# Altium schematic sheet [10] - CPU - JTAG, CONTROL.SchDoc
size A2; DocumentNumber: 10; SheetNumber: 10; SheetTotal: 20
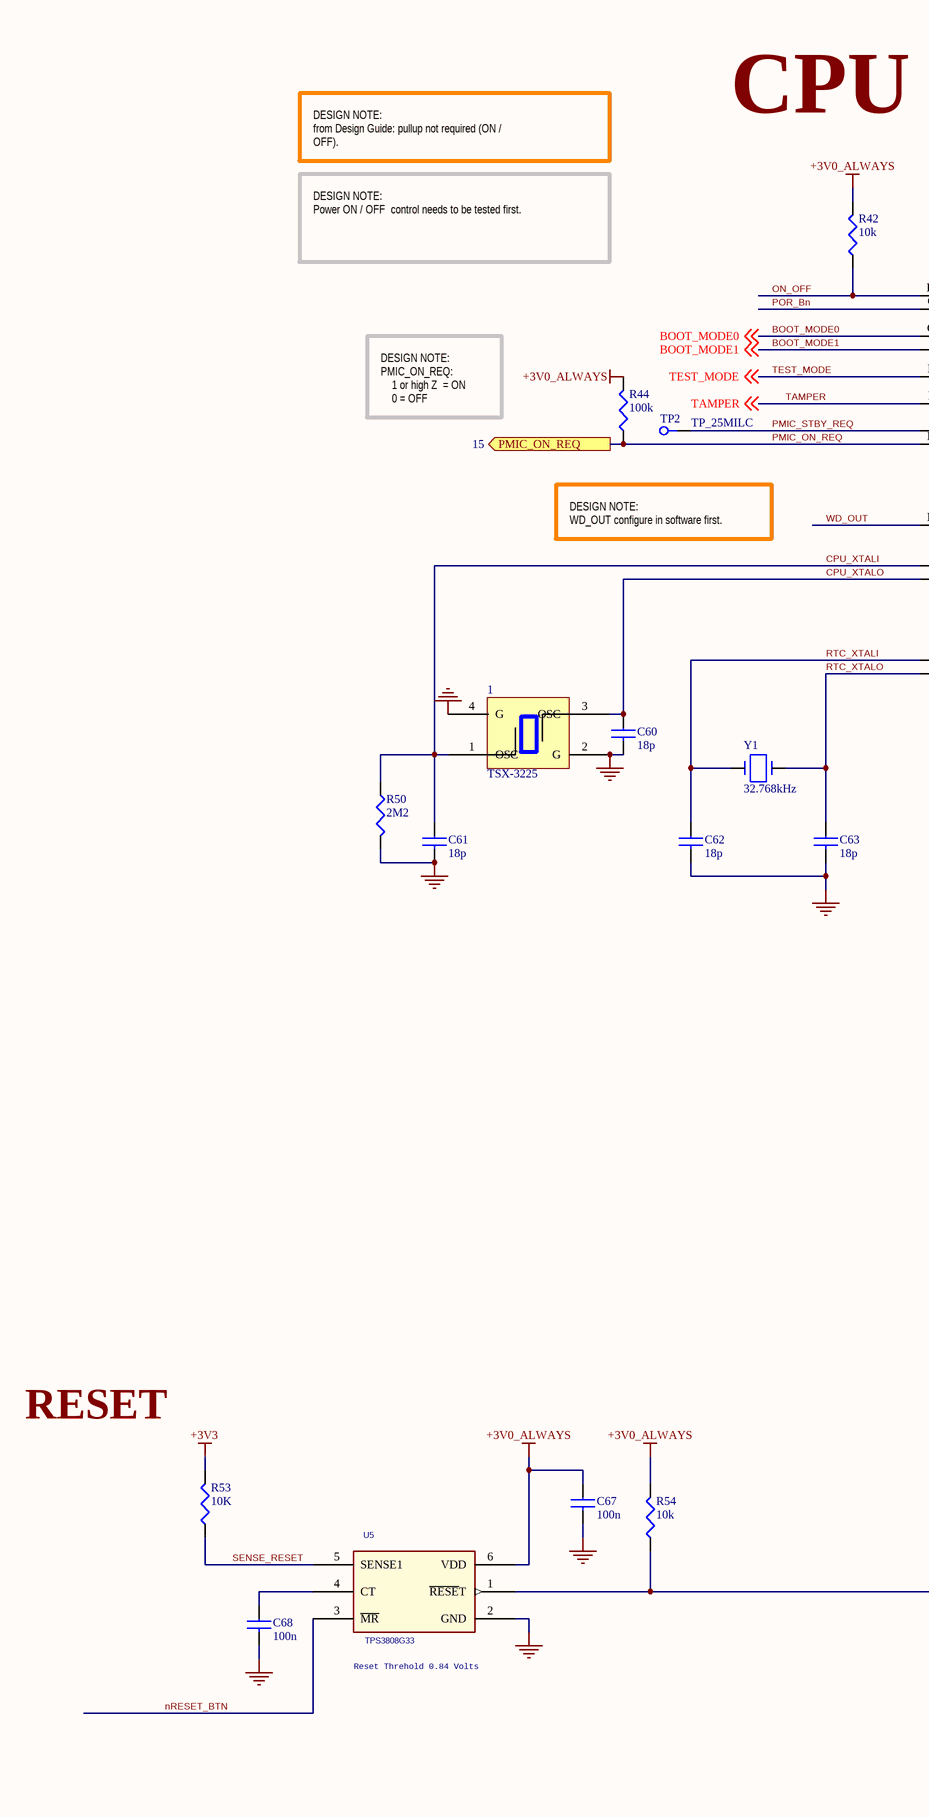
[diagram p0: [10] - CPU - JTAG, CONTROL.SchDoc, left]
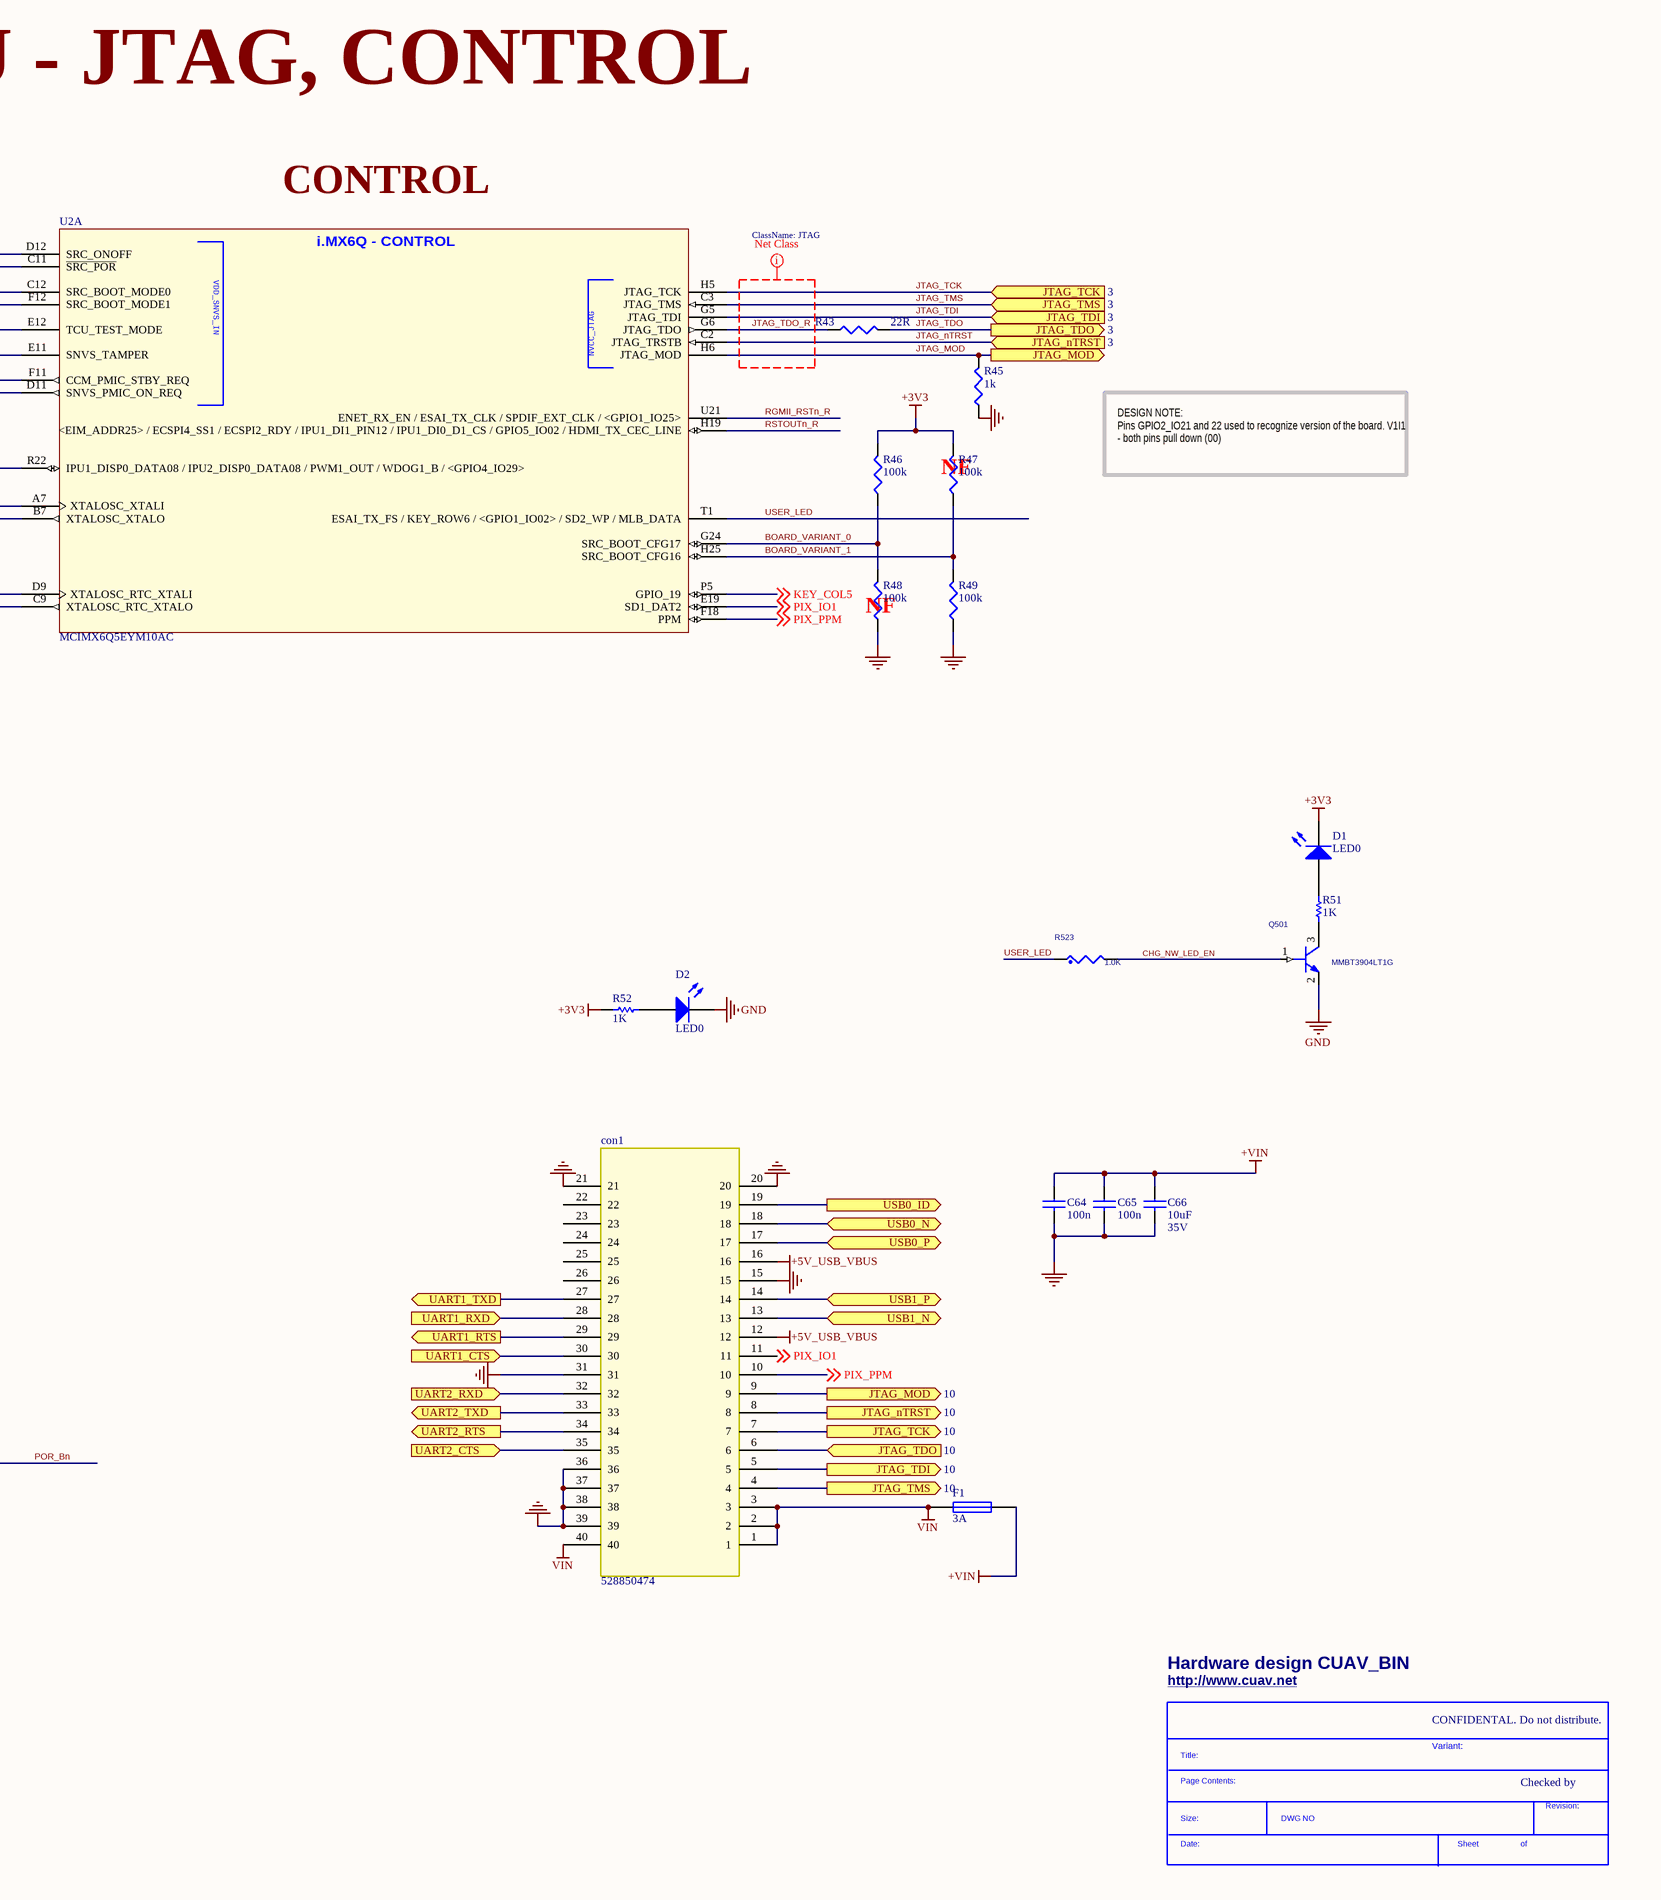
[diagram p1: [10] - CPU - JTAG, CONTROL.SchDoc, right]

## Parts
1  TSX-3225  [TSX-3225]
*  SDTitleBlock  (value not drawn)  (graphical)
C60  18p  [0402cap]
C61  18p  [0402cap]
C62  18p  [0402cap]
C63  18p  [0402cap]
C64  100n  [0402CAP]
C65  100n  [0402CAP]
C66  10uF  Voltage - Rated: 35V  [C1206A]
C67  100n  [0402cap]
C68  100n  [0402cap]
con1  528850474  [528850474]
D1  LED0  [0603-led-b]
D2  LED0  [0603-led-b]
F1  3A  [0805L]
Q501  MMBT3904LT1G  [SOT23]
R42  10k  [R0402]
R43  22R  [R0402]
R44  100k  [R0402]
R45  1k  [R0402]
R46  100k  [R0402]
R47  100k  [R0402]
R48  100k  [R0402]
R49  100k  [R0402]
R50  2M2  [R0402]
R51  1K  [R0402]
R52  1K  [R0402]
R53  10K  [R0402]
R54  10k  [R0402]
R523  1.0K  [0402_CC]
TP2  TP_25MILC  [TP_25C]  (no BOM)
U2  MCIMX6Q5EYM10AC  [PBGA624]  (part A of 15)
U5  TPS3808G33  [SOT-23-6]
Y1  32.768kHz  [ABS06]

## Ports
JTAG_MOD (out), JTAG_MOD (out, see 10), JTAG_nTRST (in, see 3), JTAG_nTRST (out, see 10), JTAG_TCK (in, see 3), JTAG_TCK (out, see 10), JTAG_TDI (in, see 3), JTAG_TDI (out, see 10), JTAG_TDO (in, see 10), JTAG_TDO (out, see 3), JTAG_TMS (in, see 3), JTAG_TMS (out, see 10), PMIC_ON_REQ (out, see 15), UART1_CTS (in), UART1_RTS (out), UART1_RXD (in), UART1_TXD (out), UART2_CTS (in), UART2_RTS (out), UART2_RXD (in), UART2_TXD (out), USB0_ID (out), USB0_N (bidir), USB0_P (bidir), USB1_N (bidir), USB1_P (bidir)

## Nets
+3V0_ALWAYS: C67.1 R42.2 R44.2 R54.2 U5.6(VDD)
+3V3: D1.2 R46.2 R47.2 R52.2 R53.2
+5V_USB_VBUS: con1.12 con1.16
+VIN: C64.1 C65.1 C66.1 F1.2
GND: 1.2(G) 1.4(G) C60.2 C61.2 C62.2 C63.2 C64.2 C65.2 C66.2 C67.2 C68.2 con1.15 con1.20 con1.21 con1.31 con1.36 con1.37 con1.38 con1.39 D2.2 Q501.2(EMITTER) R45.1 R48.1 R49.1 R50.2 U5.2(GND)
VIN: con1.1 con1.2 con1.3 con1.40 F1.1
BOARD_VARIANT_0: R46.1 R48.2 U2.G24(SRC_BOOT_CFG17)
BOARD_VARIANT_1: R47.1 R49.2 U2.H25(SRC_BOOT_CFG16)
BOOT_MODE0: U2.C12(SRC_BOOT_MODE0) ; off-sheet BOOT_MODE0
BOOT_MODE1: U2.F12(SRC_BOOT_MODE1) ; off-sheet BOOT_MODE1
CHG_NW_LED_EN: Q501.1(BASE) R523.2
CPU_XTALI: 1.1(OSC) C61.1 R50.1 U2.A7(XTALOSC_XTALI)
CPU_XTALO: 1.3(OSC) C60.1 U2.B7(XTALOSC_XTALO)
JTAG_MOD: con1.9 R45.2 U2.H6(JTAG_MOD) ; port JTAG_MOD
JTAG_nTRST: con1.8 U2.C2(JTAG_TRSTB) ; port JTAG_nTRST
JTAG_TCK: con1.7 U2.H5(JTAG_TCK) ; port JTAG_TCK
JTAG_TDI: con1.5 U2.G5(JTAG_TDI) ; port JTAG_TDI
JTAG_TDO: con1.6 R43.2 ; port JTAG_TDO
JTAG_TDO_R: R43.1 U2.G6(JTAG_TDO)
JTAG_TMS: con1.4 U2.C3(JTAG_TMS) ; port JTAG_TMS
KEY_COL5: U2.P5(GPIO_19) ; off-sheet KEY_COL5
nRESET_BTN: U5.3(~{MR})
ON_OFF: R42.1 U2.D12(SRC_ONOFF)
PIX_IO1: con1.11 U2.E19(SD1_DAT2) ; off-sheet PIX_IO1
PIX_PPM: con1.10 U2.F18(PPM) ; off-sheet PIX_PPM
PMIC_ON_REQ: R44.1 U2.D11(SNVS_PMIC_ON_REQ) ; port PMIC_ON_REQ
PMIC_STBY_REQ: TP2.1 U2.F11(CCM_PMIC_STBY_REQ)
POR_Bn: R54.1 U2.C11(~{SRC_POR}) U5.1(~{RESE}T)
RGMII_RSTn_R: U2.U21(ENET_RX_EN_/_ESAI_TX_CLK_/_SPDIF_EXT_CLK_/_<GPIO1_IO25>)
RSTOUTn_R: U2.H19(<EIM_ADDR25>_/_ECSPI4_SS1_/_ECSPI2_RDY_/_IPU1_DI1_PIN12_/_IPU1_DI0_D1_CS_/_GPIO5_IO02_/_HDMI_TX_CEC_LINE)
RTC_XTALI: C62.1 U2.D9(XTALOSC_RTC_XTALI) Y1.1
RTC_XTALO: C63.1 U2.C9(XTALOSC_RTC_XTALO) Y1.2
SENSE_RESET: R53.1 U5.5(SENSE1)
TAMPER: U2.E11(SNVS_TAMPER) ; off-sheet TAMPER
TEST_MODE: U2.E12(TCU_TEST_MODE) ; off-sheet TEST_MODE
UART1_CTS: con1.30 ; port UART1_CTS
UART1_RTS: con1.29 ; port UART1_RTS
UART1_RXD: con1.28 ; port UART1_RXD
UART1_TXD: con1.27 ; port UART1_TXD
UART2_CTS: con1.35 ; port UART2_CTS
UART2_RTS: con1.34 ; port UART2_RTS
UART2_RXD: con1.32 ; port UART2_RXD
UART2_TXD: con1.33 ; port UART2_TXD
USB0_ID: con1.19 ; port USB0_ID
USB0_N: con1.18 ; port USB0_N
USB0_P: con1.17 ; port USB0_P
USB1_N: con1.13 ; port USB1_N
USB1_P: con1.14 ; port USB1_P
USER_LED: R523.1 U2.T1(ESAI_TX_FS_/_KEY_ROW6_/_<GPIO1_IO02>_/_SD2_WP_/_MLB_DATA)
WD_OUT: U2.R22(IPU1_DISP0_DATA08_/_IPU2_DISP0_DATA08_/_PWM1_OUT_/_WDOG1_B_/_<GPIO4_IO29>)
NetC68_1: C68.1 U5.4(CT)
NetD1_1: D1.1 R51.1
NetD2_1: D2.1 R52.1
NetQ501_3: Q501.3(COLLECTOR) R51.2

Not connected (* = marked no-connect by the designer): con1 22 23 24 25 26

## Layout directives
net class JTAG: JTAG_TDO_R

## Notes on the sheet
- CPU - JTAG, CONTROL
- DESIGN NOTE:
  from Design Guide: pullup not required (ON / OFF).
- DESIGN NOTE:
  Power ON / OFF  control needs to be tested first.
- CONTROL
- DESIGN NOTE:
  PMIC_ON_REQ:
  1 or high Z  = ON
  0 = OFF
- DESIGN NOTE:
  WD_OUT configure in software first.
- (near R47) NF
- DESIGN NOTE:
  Pins GPIO2_IO21 and 22 used to recognize version of the board. V1I1 - both pins pull down (00)
- (near R48) NF
- RESET
- (near U5) Reset Threhold 0.84 Volts
- (near *) Hardware design CUAV_BIN
- (near *) http://www.cuav.net
- CONFIDENTAL. Do not distribute.
- Variant:
- Checked by
- (in symbol MCIMX6Q5EYM10AC, part A) i.MX6Q - CONTROL
- (in symbol SDTitleBlock) Title:; Page Contents:; Revision:; Size:; DWG NO; Date:; Sheet; of

## Library data of the parts
C60-C63 = C1005C0G1H180J: CAP CER 18PF 50V C0G 5% 0402; Manufacturer: TDK Corporation; .Checked PCB: used; Tolerance: ?%; Temperature Coefficient: C0G, NP0; Capacitance: 18pF; Category: Capacitors; Supplier Part Number: 445-1238-1-ND; Manufacturer Part Number: C1005C0G1H180J; Operating Temperature: -55癈 ~ 125癈; Package / Case: 0402 (1005 Metric); Price 1k [$]: 0.00468; Value: 18pF; .Checked SCH: used; Voltage - Rated: 50V; Supplier: Digikey; Supplier 1: Digi-Key; Supplier Part Number 1: 445-1238-1-ND; RoHS: RoHS Compliant; Stock 1: 24321; Pricing 1: 1=0.08, 10=0.05, 100=0.018, 250=0.013, 500=0.0096, 1000=0.0065 (USD); Mounting Type: Surface Mount, MLCC; Applications: General Purpose; Ratings: -; Size / Dimension: 0.039" L x 0.020" W (1.00mm x 0.50mm); Height - Seated (Max): -; Thickness (Max): 0.022" (0.55mm); Lead Spacing: -; Features: -; Packaging: Cut Tape (CT); Lead Style: -; ComponentLink1URL: http://www.tdk.co.jp/tefe02/e412_c.pdf; ComponentLink1Description: http://www.tdk.co.jp/tefe02/e412_c.pdf
C64 C65 C67 C68 = C1005X5R1H104K: CAP CER .10UF 50V X5R 10% 0402; Manufacturer: TDK Corporation; Capacitance: 0.1礔; Value: 100nF; .Checked PCB: used; Tolerance: ?0%; Category: Capacitors; Supplier Part Number: 445-5942-1-ND; Manufacturer Part Number: C1005X5R1H104K; Operating Temperature: -55癈 ~ 85癈; Package / Case: 0402 (1005 Metric); Price 1k [$]: 0.02340; .Checked SCH: used; Voltage - Rated: 50V; Supplier: Digikey; Supplier 1: Digi-Key; Supplier Part Number 1: 445-5942-1-ND; RoHS: RoHS Compliant; Stock 1: 106926; Pricing 1: 1=0.27, 10=0.18, 100=0.072, 250=0.05176, 500=0.0369, 1000=0.027 (USD); Temperature Coefficient: X5R; Mounting Type: Surface Mount, MLCC; Applications: General Purpose; Ratings: -; Size / Dimension: 0.039" L x 0.020" W (1.00mm x 0.50mm); Height - Seated (Max): -; Thickness (Max): 0.022" (0.55mm); Lead Spacing: -; Features: -; Packaging: Cut Tape (CT); Lead Style: -; ComponentLink1URL: http://www.tdk.co.jp/tefe02/e412_c.pdf; ComponentLink1Description: http://www.tdk.co.jp/tefe02/e412_c.pdf
C66 = GRM31CR6YA106KA12L: CAP CER 10UF 35V X5R 1206; Manufacturer: Murata Electronics North America; Capacitance: 10礔; .Checked PCB: used; Tolerance: ?0%; Category: Capacitors; Manufacturer Part Number: GRM31CR6YA106KA12L; Operating Temperature: -55癈 ~ 85癈; Package / Case: 1206 (3216 Metric); Price 1k [$]: 0.19448; Value: 10uF; .Checked SCH: used; Supplier Part Number: 490-5524-1-ND; Supplier: Digikey; Supplier 1: Digi-Key; Supplier Part Number 1: 490-5524-1-ND; RoHS: RoHS Compliant; Stock 1: 76334; Pricing 1: 1=0.6, 10=0.501, 50=0.359, 100=0.3142, 250=0.24684, 500=0.2244, 1000=0.17952 (USD); Temperature Coefficient: X5R; Mounting Type: Surface Mount, MLCC; Applications: General Purpose; Ratings: -; Size / Dimension: 0.126" L x 0.063" W (3.20mm x 1.60mm); Height - Seated (Max): -; Thickness (Max): 0.071" (1.80mm); Lead Spacing: -; Features: -; Packaging: Cut Tape (CT); Lead Style: -; ComponentLink1URL: http://www.murata.com/products/catalog/pdf/c02e.pdf; ComponentLink1Description: http://www.murata.com/products/catalog/pdf/c02e.pdf
D1 D2 = LED0: Typical INFRARED GaAs LED; Published: 8-Jun-2000; LatestRevisionDate: 08-Jul-2005; LatestRevisionNote: Mech Layer 1 removed.; PackageReference: LED-0; Publisher: Altium Limited; PackageDescription: LED; 2 Leads
F1 = Fuse 1: Fuse; Published: 8-Jun-2000; LatestRevisionDate: 17-Jul-2002; LatestRevisionNote: Re-released for DXP Platform.; PackageReference: PIN-W2/E2.8; Publisher: Altium Limited; PackageDescription: Thru-Hole; 2 Leads
Q501 = NPN: TRAN NPN GEN 200MA 40V SOT-23; CLASS: IC; CAD_APPROVED: Yes; MFG_NAME01: ON SEMICONDUCTOR; AGILE_PN: 480-75173; HEIGHT: 1.12 MM; ROHS: Yes; MFG_PN01: MMBT3904LT1G
R42 R54 = RC0402FR-0710KL: RES 10.0K OHM 1/16W 1% 0402 SMD; Manufacturer: Yageo; Power (Watts): 0.063W, 1/16W; Tolerance: ?%; .Checked PCB: used; Temperature Coefficient: ?00ppm/癈; Category: Resistors; Supplier Part Number: 311-10.0KLRCT-ND; Manufacturer Part Number: RC0402FR-0710KL; Package / Case: 0402 (1005 Metric); Price 1k [$]: 0.01421; Resistance (Ohms): 10K; Value: 10k; .Checked SCH: used; Supplier: Digikey; Supplier 1: Digi-Key; Supplier Part Number 1: 311-10.0KLRCT-ND; RoHS: RoHS Compliant; Stock 1: 2916495; Pricing 1: 10=0.014, 50=0.0104, 100=0.0079, 250=0.00584, 500=0.00432, 1000=0.00288 (USD); Composition: Thick Film; Features: -; Size / Dimension: 0.039" L x 0.020" W (1.00mm x 0.50mm); Height: 0.016" (0.40mm); Number of Terminations: 2; Packaging: Cut Tape (CT); ComponentLink1URL: http://www.yageo.com/documents/recent/PYu-RC0402_51_RoHS_L_6.pdf; ComponentLink1Description: http://www.yageo.com/documents/recent/PYu-RC0402_51_RoHS_L_6.pdf
R43 = RC0402FR-0722RL: RES 22.0 OHM 1/16W 1% 0402 SMD; Manufacturer: Yageo; Resistance (Ohms): 22; Power (Watts): 0.063W, 1/16W; Tolerance: ?%; .Checked PCB: used; Temperature Coefficient: ?00ppm/癈; Category: Resistors; Supplier Part Number: 311-22.0LRCT-ND; Manufacturer Part Number: RC0402FR-0722RL; Package / Case: 0402 (1005 Metric); Price 1k [$]: 0.01421; Value: 22R; .Checked SCH: used; Supplier: Digikey; Supplier 1: Digi-Key; Supplier Part Number 1: 311-22.0LRCT-ND; RoHS: RoHS Compliant; Stock 1: 943800; Pricing 1: 10=0.014, 50=0.0104, 100=0.0079, 250=0.00584, 500=0.00432, 1000=0.00288 (USD); Composition: Thick Film; Features: -; Size / Dimension: 0.039" L x 0.020" W (1.00mm x 0.50mm); Height: 0.016" (0.40mm); Number of Terminations: 2; Packaging: Cut Tape (CT); ComponentLink1URL: http://www.yageo.com/documents/recent/PYu-RC0402_51_RoHS_L_6.pdf; ComponentLink1Description: http://www.yageo.com/documents/recent/PYu-RC0402_51_RoHS_L_6.pdf
R44 R46-R49 = RMCF0402FT100K: RES 100K OHM 1/16W 1% 0402 SMD; Manufacturer: Stackpole Electronics Inc; Power (Watts): 0.063W, 1/16W; Tolerance: ?%; .Checked PCB: used; Temperature Coefficient: ?00ppm/癈; Category: Resistors; Supplier Part Number: RMCF0402FT100KCT-ND; Manufacturer Part Number: RMCF0402FT100K; Package / Case: 0402 (1005 Metric); Price 1k [$]: 0.00384; Resistance (Ohms): 100K; Value: 100k; .Checked SCH: used; Supplier: Digikey; Supplier 1: Digi-Key; Supplier Part Number 1: RMCF0402FT100KCT-ND; RoHS: RoHS Compliant; Stock 1: 95; Pricing 1: 1=0.04, 10=0.025, 50=0.0138, 100=0.0105, 250=0.0078, 500=0.00576, 1000=0.00384 (USD); Composition: Thick Film; Features: -; Size / Dimension: 0.039" L x 0.020" W (1.00mm x 0.50mm); Height: 0.016" (0.40mm); Number of Terminations: 2; Packaging: Cut Tape (CT); ComponentLink1URL: http://www.seielect.com/Catalog/SEI-RMCF.pdf; ComponentLink1Description: http://www.seielect.com/Catalog/SEI-RMCF.pdf
R45 = RC0402FR-071KL: RES 1.00K OHM 1/16W 1% 0402 SMD; Manufacturer: Yageo; Power (Watts): 0.063W, 1/16W; Tolerance: ?%; .Checked PCB: used; Temperature Coefficient: ?00ppm/癈; Category: Resistors; Supplier Part Number: 311-1.00KLRCT-ND; Manufacturer Part Number: RC0402FR-071KL; Package / Case: 0402 (1005 Metric); Price 1k [$]: 0.01421; Resistance (Ohms): 1K; Value: 1k; .Checked SCH: used; Supplier: Digikey; Supplier 1: Digi-Key; Supplier Part Number 1: 311-1.00KLRCT-ND; RoHS: RoHS Compliant; Stock 1: 1753477; Pricing 1: 10=0.014, 50=0.0104, 100=0.0079, 250=0.00584, 500=0.00432, 1000=0.00288 (USD); Composition: Thick Film; Features: -; Size / Dimension: 0.039" L x 0.020" W (1.00mm x 0.50mm); Height: 0.016" (0.40mm); Number of Terminations: 2; Packaging: Cut Tape (CT); ComponentLink1URL: http://www.yageo.com/documents/recent/PYu-RC0402_51_RoHS_L_6.pdf; ComponentLink1Description: http://www.yageo.com/documents/recent/PYu-RC0402_51_RoHS_L_6.pdf
R50 = CRCW04022M20FKED: RES 2.20M OHM 1/16W 1% 0402 SMD; Manufacturer: Vishay Dale; Resistance (Ohms): 2.2M; Power (Watts): 0.063W, 1/16W; Temperature Coefficient: ?00ppm/癈; Tolerance: ?%; .Creator: MM; Supplier 1: Digi-Key; Manufacturer Part Number: CRCW04022M20FKED; RoHS: RoHS Compliant; Category: Resistors; Stock 1: 77953; Pricing 1: 10=0.083, 50=0.0444, 200=0.0255, 1000=0.0174 (USD); Composition: Thick Film; Features: Automotive AEC-Q200 Qualified; Package / Case: 0402 (1005 Metric); Supplier Device Package: 0402 (1005 Metric); Size / Dimension: 0.039" L x 0.020" W (1.00mm x 0.50mm); Height: 0.016" (0.40mm); Number of Terminations: 2; Packaging: Cut Tape (CT); ComponentLink1URL: http://www.vishay.com/doc?20035; ComponentLink1Description: http://www.vishay.com/doc?20035; Supplier Part Number 1: 541-2.20MLCT-ND
R51 R52 = Res1: Resistor; Published: 8-Jun-2000; LatestRevisionDate: 17-Jul-2002; LatestRevisionNote: Re-released for DXP Platform.; PackageReference: AXIAL-0.3; Publisher: Altium Limited; PackageDescription: Axial Device, Thru-Hole; 2 Leads; 0.3 in Pin Spacing
R53 = RMCF0402FT4K99: RES TF 4.99K OHM 1% 1/16W 0402; Manufacturer: Stackpole Electronics Inc; Power (Watts): 0.063W, 1/16W; Tolerance: ?%; Value: 4k99; .Checked PCB: used; Temperature Coefficient: ?00ppm/癈; Category: Resistors; Manufacturer Part Number: RMCF0402FT4K99; Package / Case: 0402 (1005 Metric); Price 1k [$]: 0.00384; Resistance (Ohms): 10K; .Checked SCH: used; Supplier Part Number: RMCF0402FT4K99CT-ND; Supplier: Digikey; Supplier 1: Digi-Key; Supplier Part Number 1: RMCF0402FT4K99CT-ND; RoHS: RoHS Compliant; Stock 1: 48509; Pricing 1: 1=0.04, 10=0.025, 50=0.0138, 100=0.0105, 250=0.0078, 500=0.00576, 1000=0.00384 (USD); Composition: Thick Film; Features: -; Size / Dimension: 0.039" L x 0.020" W (1.00mm x 0.50mm); Height: 0.016" (0.40mm); Number of Terminations: 2; Packaging: Cut Tape (CT); ComponentLink1URL: http://www.seielect.com/Catalog/SEI-RMCF.pdf; ComponentLink1Description: http://www.seielect.com/Catalog/SEI-RMCF.pdf
R523 = RES: RES MF 1.0K 1/16W 1% 0402; CLASS: DISCRETE; AGILE_PN: 470-76037; MFG_NAME01: KOA SPEER; MFG_PN01: RK73H1ETTP1001F; CAD_APPROVED: Yes; FPLIST: RC0402_25,RC0402_HD,RC0402_X2,0402_CC; SIGNAL_MODEL: DEFAULT_RESISTOR_1000OHM_2_1; Tolerance: 1%; ROHS: Yes
TP2 = TP_25MILC: Test Point 25mil
U2 = MCIMX6Q5EYM10AC: IC MCU 32BIT ARM QUAD 624FCBGA; Manufacturer: Freescale Semiconductor; Core Processor: ARM?Cortex?A9; Core Size: 32-Bit Quad-Core; Speed: 1.0GHz; Connectivity: CAN, EBI/EMI, ESAI, Ethernet, GPMI, I2C, MMC/SD, PCI, SATA, SPI, UART, USB, USB OTG; Peripherals: DMA, HDMI, I2S/SSI/AC97, MIPI CSI, MIMI DSI, MIPI HIS, PWM, WDT; Number of I /O: 224; Program Memory Type: External Program Memory; RAM Size: 256K x 8; Voltage - Supply (Vcc/Vdd): 0.925 V ~ 1.5 V; Oscillator Type: Internal; .Creator: MM; .Checked PCB: MM, checked by RF; Supplier 1: Digi-Key; Manufacturer Part Number: MCIMX6Q5EYM10AC; RoHS: RoHS Compliant; Category: Integrated Circuits (ICs); Stock 1: 0; Pricing 1: 1=54.98, 10=51.922, 25=48.868, 100=30.5424 (USD); Program Memory Size: -; EEPROM Size: -; Data Converters: -; Operating Temperature: -20癈 ~ 105癈; Package / Case: 624-FBGA, FCBGA; Packaging: Tray; ComponentLink1URL: http://cache.freescale.com/files/32bit/doc/data_sheet/IMX6DQCEC.pdf; ComponentLink1Description: http://cache.freescale.com/files/32bit/doc/data_sheet/IMX6DQCEC.pdf; Supplier Part Number 1: MCIMX6Q5EYM10AC-ND; .Checked SCH: MM
U5 = TPS3808G09DBVR: IC VOLT SUPERVISOR 0.9V SOT23-6; Part #: 102020-0009R; Manufacturer: Texas Instruments; .Checked PCB: used; Number of Voltages Monitored: 1; Output: Open Drain or Open Collector; Reset: Active Low; Reset Timeout: Adjustable/Selectable; Voltage - Threshold: 0.84V; .Checked SCH: used; Category: Integrated Circuits (ICs); Supplier Part Number: 296-17189-1-ND; Family: PMIC - Supervisors; Manufacturer Part Number: TPS3808G09DBVR; Operating Temperature: -40癈 ~ 125癈; Package / Case: SOT-23-6; Price 1k [$]: 1.12000; Value: TPS3808G09DBVR; Type: Simple Reset/Power-On Reset; Supplier: Digikey; Supplier 1: Digi-Key; Supplier Part Number 1: 296-17189-1-ND; RoHS: RoHS Compliant; Stock 1: 61681; Pricing 1: 1=2.45, 25=1.89, 100=1.715, 250=1.54, 500=1.33, 1000=1.12 (USD); Mounting Type: Surface Mount; Supplier Device Package: SOT-23-6; Packaging: Cut Tape (CT); ComponentLink1URL: http://www.ti.com/lit/ds/symlink/tps3808g01.pdf; ComponentLink1Description: http://www.ti.com/lit/ds/symlink/tps3808g01.pdf
Y1 = ABS06-32.768KHZ-9-1-T: CRYSTAL 32.768 KHZ 9.0 PF SMD; Manufacturer: Abracon Corporation; .Checked PCB: used; Frequency Stability: ?0ppm; Load Capacitance: 9pF; Operating Mode: Fundamental; .Checked SCH: used; Category: Crystals and Oscillators; Supplier Part Number: 535-10247-1-ND; Manufacturer Part Number: ABS06-32.768KHZ-9-1-T; Operating Temperature: -40癈 ~ 85癈; Package / Case: 2-SMD, No Lead (DFN, LCC); Price 1k [$]: 1.24500; Value: 32.768kHz; Frequency: 32.768kHz; Supplier: Digikey; Supplier 1: Digi-Key; Supplier Part Number 1: 535-10247-1-ND; RoHS: RoHS Compliant; Stock 1: 5693; Pricing 1: 1=2.81, 10=2.438, 50=2.1376, 100=1.6875, 500=1.425 (USD); Type: kHz Crystal (Tuning Fork); Frequency Tolerance: ?0ppm; Mounting Type: Surface Mount; Size / Dimension: 0.079" L x 0.047" W (2.00mm x 1.20mm); Height: 0.024" (0.60mm); Packaging: Cut Tape (CT); ComponentLink1URL: http://www.abracon.com/Resonators/ABS06.pdf; ComponentLink1Description: http://www.abracon.com/Resonators/ABS06.pdf